# Altium schematic sheet USB-to-JTAG.SchDoc: USB to JTAG
size A4; DrawnBy: Fred Vatnsdal; SheetNumber: 1
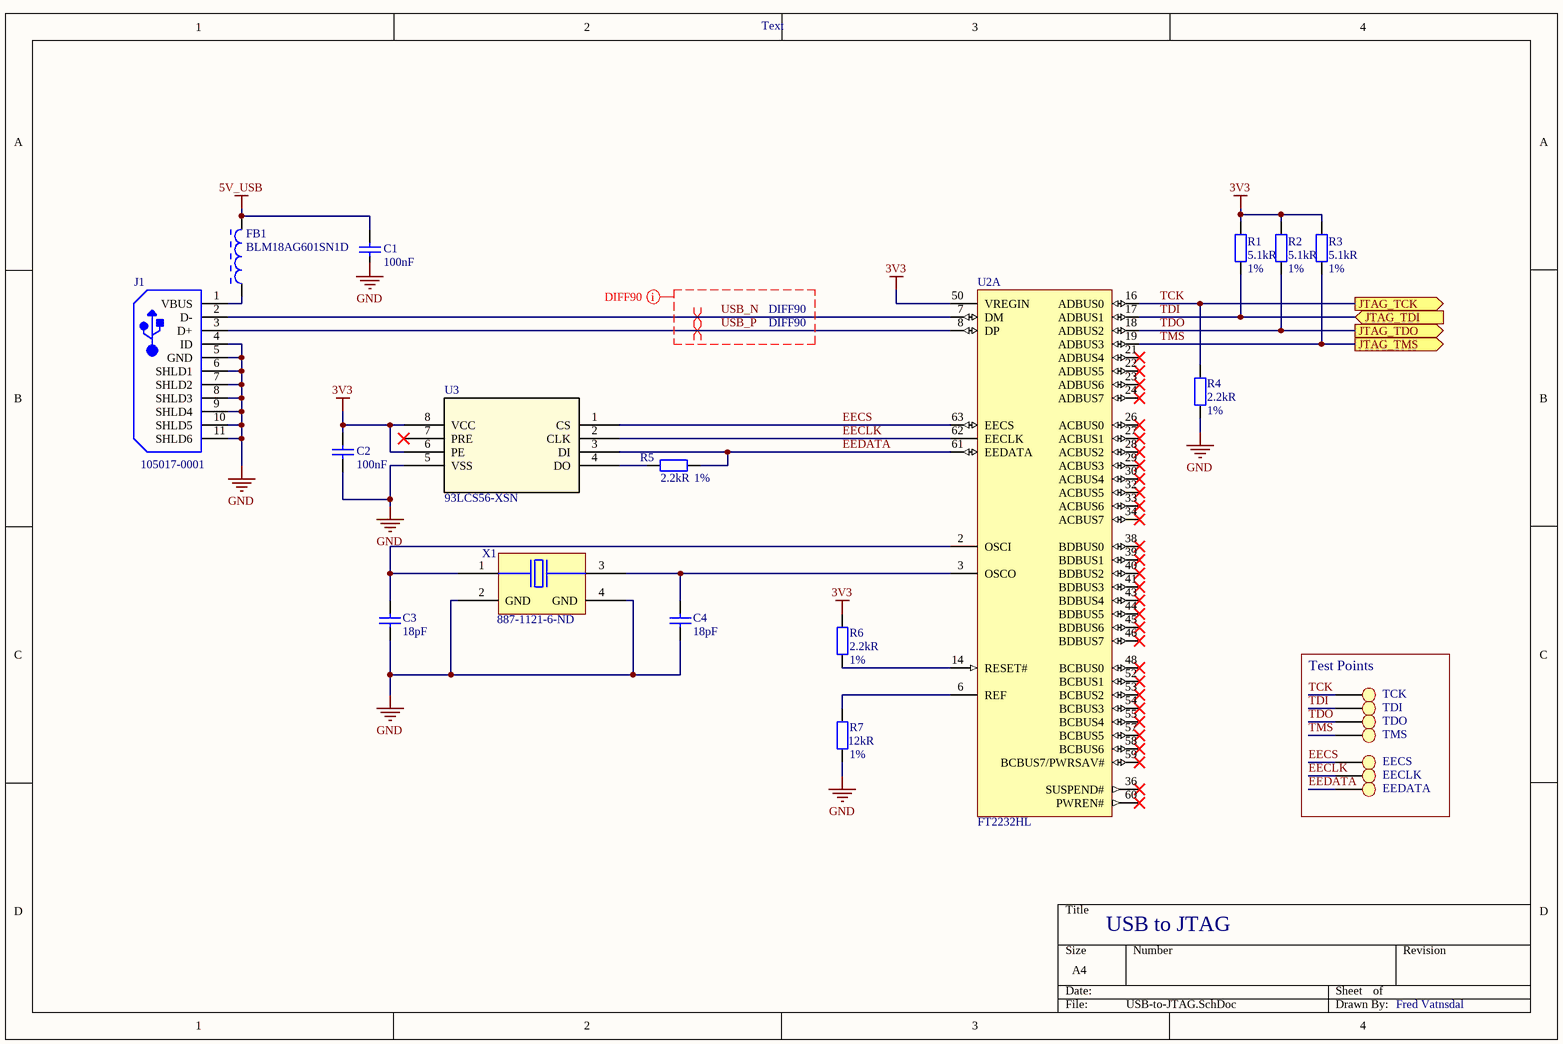
[diagram p0: USB-to-JTAG.SchDoc]

## Parts
C1  Capacitance: 100nF  [CAP_0402_imperial]  (hidden comment: C0402C104K4RACTU)
C2  Capacitance: 100nF  [CAP_0402_imperial]  (hidden comment: C0402C104K4RACTU)
C3  Capacitance: 18pF  [CAP_0402_imperial]  (hidden comment: C0402C180K3GACTU)
C4  Capacitance: 18pF  [CAP_0402_imperial]  (hidden comment: C0402C180K3GACTU)
EECLK  TP  [TP_0.75DIA]  (value not drawn)
EECS  TP  [TP_0.75DIA]  (value not drawn)
EEDATA  TP  [TP_0.75DIA]  (value not drawn)
FB1  BLM18AG601SN1D  [MURA-BLM18-F-H1-CHIP-2_V]
J1  105017-0001  [USB-MICRO-B_V]
R1  Tolerance: 1%  Resistance: 5.1kR  [RES_0402_imperial]  (hidden comment: 5K1 1% 0402(1005))
R2  Tolerance: 1%  Resistance: 5.1kR  [RES_0402_imperial]  (hidden comment: 5K1 1% 0402(1005))
R3  Tolerance: 1%  Resistance: 5.1kR  [RES_0402_imperial]  (hidden comment: 5K1 1% 0402(1005))
R4  Tolerance: 1%  Resistance: 2.2kR  [RES_0402_imperial]  (hidden comment: 2K2 1% 0402(1005))
R5  Tolerance: 1%  Resistance: 2.2kR  [RES_0402_imperial]  (hidden comment: 2K2 1% 0402(1005))
R6  Tolerance: 1%  Resistance: 2.2kR  [RES_0402_imperial]  (hidden comment: 2K2 1% 0402(1005))
R7  Resistance: 12kR  Tolerance: 1%  [RES_0402_imperial]  (hidden comment: RC0402FR-0712KL)
TCK  TP  [TP_0.75DIA]  (value not drawn)
TDI  TP  [TP_0.75DIA]  (value not drawn)
TDO  TP  [TP_0.75DIA]  (value not drawn)
TMS  TP  [TP_0.75DIA]  (value not drawn)
U2  FT2232HL  [FTDI-LQFP-64_L]  (part A of 2)
U3  93LCS56-XSN  [SOIC8-N_MC]
X1  Supplier Part Number 1: 887-1121-6-ND  [7M-12.000MAAJ-T]  (hidden comment: 7M-12.000MAAJ-T)

## Blocks framed on the sheet
Test Points: EECLK EECS EEDATA TCK TDI TDO TMS

## Ports
JTAG_TCK (out), JTAG_TDI (in), JTAG_TDO (out), JTAG_TMS (out)

## Nets
3V3: C2.1 R1.2 R2.2 R3.2 R6.2 U2.50(VREGIN) U3.6(PE) U3.8(VCC)
5V_USB: C1.1 FB1.2
GND: C2.2 C3.2 C4.2 J1.4(ID) J1.5(GND) J1.6(SHLD1) J1.7(SHLD2) J1.8(SHLD3) J1.9(SHLD4) J1.10(SHLD5) J1.11(SHLD6) R4.1 R7.1 U3.5(VSS) X1.2(GND) X1.4(GND)
EECLK: EECLK.1 U2.62(EECLK) U3.2(CLK)
EECS: EECS.1 U2.63(EECS) U3.1(CS)
EEDATA: EEDATA.1 R5.1 U2.61(EEDATA) U3.3(DI)
TCK: R4.2 TCK.1 U2.16(ADBUS0) ; port JTAG_TCK
TDI: R1.1 TDI.1 U2.17(ADBUS1) ; port JTAG_TDI
TDO: R2.1 TDO.1 U2.18(ADBUS2) ; port JTAG_TDO
TMS: R3.1 TMS.1 U2.19(ADBUS3) ; port JTAG_TMS
USB_N: J1.2(D-) U2.7(DM)
USB_P: J1.3(D+) U2.8(DP)
NetC3_1: C3.1 U2.2(OSCI) X1.1
NetC4_1: C4.1 U2.3(OSCO) X1.3
NetFB1_1: FB1.1 J1.1(VBUS)
NetR5_2: R5.2 U3.4(DO)
NetR6_1: R6.1 U2.14(RESET#)
NetR7_2: R7.2 U2.6(REF)

Not connected (* = marked no-connect by the designer): C1 2; U2 21(ADBUS4)* 22(ADBUS5)* 23(ADBUS6)* 24(ADBUS7)* 26(ACBUS0)* 27(ACBUS1)* 28(ACBUS2)* 29(ACBUS3)* 30(ACBUS4)* 32(ACBUS5)* 33(ACBUS6)* 34(ACBUS7)* 36(SUSPEND#)* 38(BDBUS0)* 39(BDBUS1)* 40(BDBUS2)* 41(BDBUS3)* 43(BDBUS4)* 44(BDBUS5)* 45(BDBUS6)* 46(BDBUS7)* 48(BCBUS0)* 52(BCBUS1)* 53(BCBUS2)* 54(BCBUS3)* 55(BCBUS4)* 57(BCBUS5)* 58(BCBUS6)* 59(BCBUS7/PWRSAV#)* 60(PWREN#)*; U3 7(PRE)*

## Layout directives
differential pair: USB_N, USB_P
net class DIFF90: USB_N, USB_P

## Notes on the sheet
- Text
- DIFF90
- Labels drawn without touching a wire or pin: GND

## Library data of the parts
C1 C2 = C0402C104K4RAC-TU: CAP CER 0.1UF 16V X7R 0402; Manufacturer: KEMET; Dielectric Material: Ceramic; Dissipation Factor: 3.5%; Tolerance: 10%; Supplier 1: Digi-Key; Manufacturer Part Number: C0402C104K4RAC-TU; Stock 1: 0; Mount: Surface Mount,PCB; Case/Package: 0402; Number of Pins: 2; Case Code (Metric): 1005; Case Code (Imperial): 0402; Contact Plating: Tin,Matte; Min Operating Temperature: -55°C; Max Operating Temperature: 125°C; Packaging: Tape and Reel; Voltage Rating (DC): 16V; Dielectric: X7R; Voltage Rating: 16V; Package Quantity: 1; Termination: SMD/SMT; Length: 1mm; Height: 0.5mm; Width: 0.02inch; Depth: 0.5mm; Thickness: 0.022inch; Lead Pitch: 0.3mm; Radiation Hardening: No; REACH SVHC: No SVHC; ComponentLink1URL: https://datasheet.ciiva.com/28645/1851736-28645381.pdf; ComponentLink1Description: https://datasheet.ciiva.com/28645/1851736-28645381.pdf; ComponentLink2URL: https://datasheet.ciiva.com/5418/kem-c1002-x7r-smd-5418136.pdf; ComponentLink2Description: https://datasheet.ciiva.com/5418/kem-c1002-x7r-smd-5418136.pdf; ComponentLink3URL: https://datasheet.ciiva.com/14586/70095383-14586056.pdf; ComponentLink3Description: https://datasheet.ciiva.com/14586/70095383-14586056.pdf; ComponentLink4URL: https://datasheet.ciiva.com/18100/getdatasheetpartid-37082-18100986.pdf; ComponentLink4Description: https://datasheet.ciiva.com/18100/getdatasheetpartid-37082-18100986.pdf; ComponentLink5URL: https://datasheet.ciiva.com/14603/70095383-14603039.pdf; ComponentLink5Description: https://datasheet.ciiva.com/14603/70095383-14603039.pdf; Supplier Part Number 1: 399-3521-6-ND; Voltage: 16V
C3 C4 = C0402C180K3GACTU: CAP CER 18PF 25V NP0 0402; Manufacturer: KEMET; Dielectric Material: Ceramic; Dielectric: C0G; Dissipation Factor: 0.1%; Tolerance: 10%; Supplier 1: Digi-Key; Manufacturer Part Number: C0402C180K3GACTU; Stock 1: 0; Mount: Surface Mount; Case/Package: 0402; Case Code (Metric): 1005; Case Code (Imperial): 0402; Min Operating Temperature: -55°C; Max Operating Temperature: 125°C; Packaging: Tape and Reel; Voltage Rating (DC): 25V; Package Quantity: 10000; Termination: SMD/SMT; Length: 1mm; Height: 0.5mm; Depth: 0.5mm; Width: 0.02inch; Thickness: 0.022inch; Lead Pitch: 0.3mm; Lead Free: Lead Free; ComponentLink1URL: https://datasheet.ciiva.com/13376/kem-c1003-c0g-smd-356956-13376925.pdf; ComponentLink1Description: https://datasheet.ciiva.com/13376/kem-c1003-c0g-smd-356956-13376925.pdf; Supplier Part Number 1: C0402C180K3GACTU-ND; Voltage Rating: 25V
FB1 = CMP-0686-00436-2: Chip Ferrite Bead for General Use, 600 Ohm, 500 mA, -55 to 125 degC, 1.6 x 0.8 x 0.95 mm SMD, Tape and Reel; Manufacturer: Murata; DC Resistance: 0.38 Ohm Max.; Impedance (at 100 MHz): 600 Ohm +/- 25%; Rated Current: 500 mA; ComponentLink3Description: Package Specification; ComponentLink1Description: Manufacturer URL; ComponentLink1URL: http://www.murata.com/; DatasheetVersion: 08/2013; ComponentLink2URL: http://www.murata.com/products/catalog/pdf/c31e.pdf; PackageReference: BLM18_H950-2; PackageDescription: 2-Pin Chip, Body 1.6 x 0.8 mm; PartNumber: BLM18AG601SN1D; Mounting Technology: Surface Mount; ComponentLink2Description: Datasheet; Packing: Tape and Reel; ComponentLink3URL: http://www.murata.com/products/catalog/pdf/c31e.pdf; Operating Temperature Range: -55 to 125 degC
J1 = CMP-2000-05827-1: Micro-USB B Receptacle, Right Angle, Bottom Mount, Surface Mount, with Solder Tabs, -30 to 85 degC, 5-Pin USB, RoHS, Tape and Reel; Manufacturer: Molex; Featured Product: Micro-USBConnectorsUSBConnectors; Other Names: WM1399DKR; Package Version: Rev. F, 12/2012; Number of Contacts: 5; Connector Type: USB-microB; Catalog Drawings: 1050170001; 3D Model: 105017-0001.stp; Mating Products: WM17145-ND-CABLEMICROUSBBTOSTDA1.0MWM17147-ND-CABLEMICROUSBBTOSTDA2.0MWM17146-ND-CABLEMICROUSBBTOSTDA1.5M; PCN Assembly/Origin: ResinSupplier21/Oct/2015; Voltage - Max: 30V; Online Catalog: Molex-MicroUSB; Manufacturer URL: http://www.molex.com/; Package Description: 5-Leads USB, Micro B, Body 7.5 x 5 mm, Pitch 0.65 mm; Datasheet URL: http://www.molex.com/elqNow/elqRedir.htm?ref=http://www.molex.com/webdocs/datasheets/pdf/en-us/1050170001_IO_CONNECTORS.pdf; Ingress Protection: -; Datasheet Version: 03/2016; Mounting Type: BoardCutout,SurfaceMount,RightAngle; Circuits: 5; Standard Package: 1; Package Reference: MICRO-B; Package URL: http://www.molex.com/pdm_docs/sd/1050170001_sd.pdf; Category: Connectors,Interconnects; Series: -; RoHS Information: 1050170001CertofCompliance; Features: Shielded,SolderRetention; Family: USB,DVI,HDMIConnectors; Specifications: -; Gender: Receptacle; Packaging: Digi-Reel®; Mounting Technology: SurfaceMount
R1-R3 = RC0402FR-075K1L: RES SMD 5.1K OHM 1% 1/16W 0402; Manufacturer: Yageo; Power Rating: 63mW; Voltage Rating: 50V; Temperature Coefficient: 100ppm/°C; Supplier 1: Digi-Key; Manufacturer Part Number: RC0402FR-075K1L; Stock 1: 0; Pricing 1: 1=0.1, 10=0.016, 100=0.0066, 1000=0.00299, 2500=0.00259, 5000=0.00214 (USD); Case/Package: 0402; Case Code (Metric): 1005; Case Code (Imperial): 0402; Min Operating Temperature: -55°C; Max Operating Temperature: 155°C; Packaging: Tape and Reel; Package Quantity: 1; Composition: Thick Film; Number of Terminations: 2; Termination: SMD/SMT; Military Standard: Not; Max Power Dissipation: 63mW; Voltage Rating (DC): 50V; Working Voltage: 50V; Features: Moisture Resistant; Length: 1mm; Height: 0.016inch; Width: 0.02inch; Depth: 0.5mm; REACH SVHC: Unknown; Lead Free: Lead Free; ComponentLink1URL: https://datasheet.ciiva.com/15189/getdatasheetpartid-323636-15189493.pdf; ComponentLink1Description: https://datasheet.ciiva.com/15189/getdatasheetpartid-323636-15189493.pdf; ComponentLink2URL: https://datasheet.ciiva.com/2453/pyu-r-int-thick-7-2453400.pdf; ComponentLink2Description: https://datasheet.ciiva.com/2453/pyu-r-int-thick-7-2453400.pdf; ComponentLink3URL: https://datasheet.ciiva.com/46394/1018594-46394936.pdf; ComponentLink3Description: https://datasheet.ciiva.com/46394/1018594-46394936.pdf; ComponentLink4URL: https://datasheet.ciiva.com/2453/pyu-r-int-thick-7-2453401.pdf; ComponentLink4Description: https://datasheet.ciiva.com/2453/pyu-r-int-thick-7-2453401.pdf; ComponentLink5URL: https://datasheet.ciiva.com/2453/pyu-r-int-thick-7-2453402.pdf; ComponentLink5Description: https://datasheet.ciiva.com/2453/pyu-r-int-thick-7-2453402.pdf; ComponentLink6URL: https://datasheet.ciiva.com/16744/pyu-rc0402-51-rohs-l-6-r-16744283.pdf; ComponentLink6Description: https://datasheet.ciiva.com/16744/pyu-rc0402-51-rohs-l-6-r-16744283.pdf; ComponentLink7URL: https://datasheet.ciiva.com/12558/pyu-rc0402-51-rohs-l-6-r-8721-12558460.pdf; ComponentLink7Description: https://datasheet.ciiva.com/12558/pyu-rc0402-51-rohs-l-6-r-8721-12558460.pdf; ComponentLink8URL: https://datasheet.ciiva.com/7983/1018594-7983519.pdf; ComponentLink8Description: https://datasheet.ciiva.com/7983/1018594-7983519.pdf; Supplier Part Number 1: 311-5.10KLRDKR-ND
R4-R6 = RC0402FR-072K2L: YAGEO (PHYCOMP)         RC0402FR-072K2L             SMD Chip Resistor, Thick Film, 2.2 kohm, 50 V, 0402 [1005 Metric], 63 mW,  1%; Power Rating: 63mW; Voltage Rating: 50V; Temperature Coefficient: 100ppm/°C; Supplier 1: Digi-Key; Manufacturer: Yageo; Manufacturer Part Number: RC0402FR-072K2L; Stock 1: 0; Pricing 1: 1=0.1, 10=0.018, 100=0.0073, 1000=0.00329, 2500=0.00286, 5000=0.00236 (USD); Case/Package: 0402; Weight: 2.3E-05oz; Case Code (Imperial): 0402; Case Code (Metric): 1005; Min Operating Temperature: -55°C; Max Operating Temperature: 155°C; Packaging: Tape and Reel; Termination: SMD/SMT; Composition: Thick Film; Military Standard: Not; Length: 1mm; Height: 0.35mm; Width: 0.5mm; Depth: 0.5mm; REACH SVHC: Unknown; Lead Free: Lead Free; ComponentLink1URL: https://datasheet.ciiva.com/11808/0900766b80c66297-11808786.pdf; ComponentLink1Description: https://datasheet.ciiva.com/11808/0900766b80c66297-11808786.pdf; ComponentLink2URL: https://datasheet.ciiva.com/12577/pyu-rc0402-51-rohs-l-6-r-12577429.pdf; ComponentLink2Description: https://datasheet.ciiva.com/12577/pyu-rc0402-51-rohs-l-6-r-12577429.pdf; ComponentLink3URL: https://datasheet.ciiva.com/16741/pyu-rc0402-51-rohs-l-6-r-16741015.pdf; ComponentLink3Description: https://datasheet.ciiva.com/16741/pyu-rc0402-51-rohs-l-6-r-16741015.pdf; ComponentLink4URL: https://datasheet.ciiva.com/7849/1018594-7849928.pdf; ComponentLink4Description: https://datasheet.ciiva.com/7849/1018594-7849928.pdf; ComponentLink5URL: https://datasheet.ciiva.com/7849/1018594-7849929.pdf; ComponentLink5Description: https://datasheet.ciiva.com/7849/1018594-7849929.pdf; ComponentLink6URL: https://datasheet.ciiva.com/7983/1018594-7983515.pdf; ComponentLink6Description: https://datasheet.ciiva.com/7983/1018594-7983515.pdf; ComponentLink7URL: https://datasheet.ciiva.com/46383/1018594-46383563.pdf; ComponentLink7Description: https://datasheet.ciiva.com/46383/1018594-46383563.pdf; Supplier Part Number 1: 311-2.20KLRDKR-ND
R7 = RC0402FR-0712KL: RES SMD 12K OHM 1% 1/16W 0402; Manufacturer: Yageo; Power Rating: 62.5mW; Voltage Rating: 50V; Max Power Dissipation: 63mW; Temperature Coefficient: 100ppm/°C; Supplier 1: Digi-Key; Manufacturer Part Number: RC0402FR-0712KL; Stock 1: 0; Pricing 1: 1=0.1, 10=0.018, 100=0.0073, 1000=0.00329, 2500=0.00286, 5000=0.00236 (USD); Case/Package: 0402; Weight: 2.3E-05oz; Case Code (Metric): 1005; Case Code (Imperial): 0402; Min Operating Temperature: -55°C; Max Operating Temperature: 155°C; Packaging: Tape and Reel; Package Quantity: 1; Composition: Thick Film; Number of Terminations: 2; Termination: SMD/SMT; Military Standard: Not; Features: Moisture Resistant; Length: 1mm; Height: 0.016inch; Width: 0.02inch; Depth: 0.5mm; REACH SVHC: No SVHC; Lead Free: Lead Free; ComponentLink1URL: https://datasheet.ciiva.com/2453/pyu-r-int-thick-7-2453379.pdf; ComponentLink1Description: https://datasheet.ciiva.com/2453/pyu-r-int-thick-7-2453379.pdf; ComponentLink2URL: https://datasheet.ciiva.com/2453/pyu-r-int-thick-7-2453380.pdf; ComponentLink2Description: https://datasheet.ciiva.com/2453/pyu-r-int-thick-7-2453380.pdf; ComponentLink3URL: https://datasheet.ciiva.com/2453/pyu-r-int-thick-7-2453381.pdf; ComponentLink3Description: https://datasheet.ciiva.com/2453/pyu-r-int-thick-7-2453381.pdf; ComponentLink4URL: https://datasheet.ciiva.com/12577/pyu-rc0402-51-rohs-l-6-r-12577269.pdf; ComponentLink4Description: https://datasheet.ciiva.com/12577/pyu-rc0402-51-rohs-l-6-r-12577269.pdf; ComponentLink5URL: https://datasheet.ciiva.com/7849/1018594-7849832.pdf; ComponentLink5Description: https://datasheet.ciiva.com/7849/1018594-7849832.pdf; ComponentLink6URL: https://datasheet.ciiva.com/7849/1018594-7849833.pdf; ComponentLink6Description: https://datasheet.ciiva.com/7849/1018594-7849833.pdf; ComponentLink7URL: https://datasheet.ciiva.com/16744/pyu-rc0402-51-rohs-l-6-r-16744492.pdf; ComponentLink7Description: https://datasheet.ciiva.com/16744/pyu-rc0402-51-rohs-l-6-r-16744492.pdf; ComponentLink8URL: https://datasheet.ciiva.com/46412/1018594-46412831.pdf; ComponentLink8Description: https://datasheet.ciiva.com/46412/1018594-46412831.pdf; Supplier Part Number 1: 311-12.0KLRDKR-ND
U2 = CMP-2000-06287-1: Dual High Speed USB to Multipurpose UART / FIFO IC / , 3 to 3.6 V, -40 to 85 degC, 64- Pin LQFP, RoHS; Manufacturer: FTDI; Number of Channels per Chip: 2; Standard Supported: RS232,RS422,RS485; Maximum Data Rate: 480Mbit/s; Package Description: 64-Pin Low-profile Quad Flat Package, Body 10 x 10 mm, Pitch 0.5 mm; Maximum Operating Temperature: +85°C; Mounting Technology: SurfaceMount; Pin Count: 64; Package Reference: LQFP-64; Manufacturer URL: http://www.nxp.com/; Length: 10mm; Width: 10mm; Minimum Operating Temperature: -40°C; Dimensions: 10x10x1.4mm; Package Type: LQFP; Mounting Type: SurfaceMount; Datasheet URL: http://www.ftdichip.com/Support/Documents/DataSheets/ICs/DS_FT2232H.pdf; Datasheet Version: Rev. 2.5, 07/2016; Height: 1.4mm; PartId: 1
U3 = 93LCS56-XSN: Imported; RefDes: RefDes; Type: DEV; Value: Value
X1 = 7M-12.000MAAJ-T: 12MHz ±30ppm Crystal 18pF 100 Ohm -20°C ~ 70°C  Surface Mount 4-SMD, No Lead (DFN, LCC); Manufacturer: TXC; ESR (Equivalent Series Resistance): 100R; Supplier 1: Digi-Key; Manufacturer Part Number: 7M-12.000MAAJ-T; Stock 1: 18420; Pricing 1: 1=1, 10=0.886, 50=0.8278, 100=0.7315, 500=0.693, 1000=0.5775 (USD); Mount: Surface Mount; Case/Package: SMD/SMT; Number of Pins: 4; Min Operating Temperature: -20°C; Max Operating Temperature: 70°C; Package Quantity: 3000; Frequency: 12MHz; Frequency Tolerance: 30ppm; Load Capacitance: 18pF; Packaging: Tape and Reel; Tolerance: 30ppm; Frequency Stability: 30ppm; Termination: SMD/SMT; Length: 3.2mm; Height: 0.031inch; Width: 0.098inch; Depth: 2.5mm; REACH SVHC: No SVHC; Lead Free: Lead Free; ComponentLink1URL: https://datasheet.ciiva.com/855/7m-855345.pdf; ComponentLink1Description: https://datasheet.ciiva.com/855/7m-855345.pdf; ComponentLink2URL: https://datasheet.ciiva.com/855/7m-855346.pdf; ComponentLink2Description: https://datasheet.ciiva.com/855/7m-855346.pdf; ComponentLink3URL: https://datasheet.ciiva.com/855/7m-855347.pdf; ComponentLink3Description: https://datasheet.ciiva.com/855/7m-855347.pdf; ComponentLink4URL: https://datasheet.ciiva.com/46431/7m-46431979.pdf; ComponentLink4Description: https://datasheet.ciiva.com/46431/7m-46431979.pdf; ComponentLink5URL: https://datasheet.ciiva.com/1356/number-crystal-basic-1356573.pdf; ComponentLink5Description: https://datasheet.ciiva.com/1356/number-crystal-basic-1356573.pdf